# Altium schematic sheet MotorCellTwo.SchDoc: ODRIVE-FOC
size A3; DocumentNumber: SEASKY; Revision: V1.1
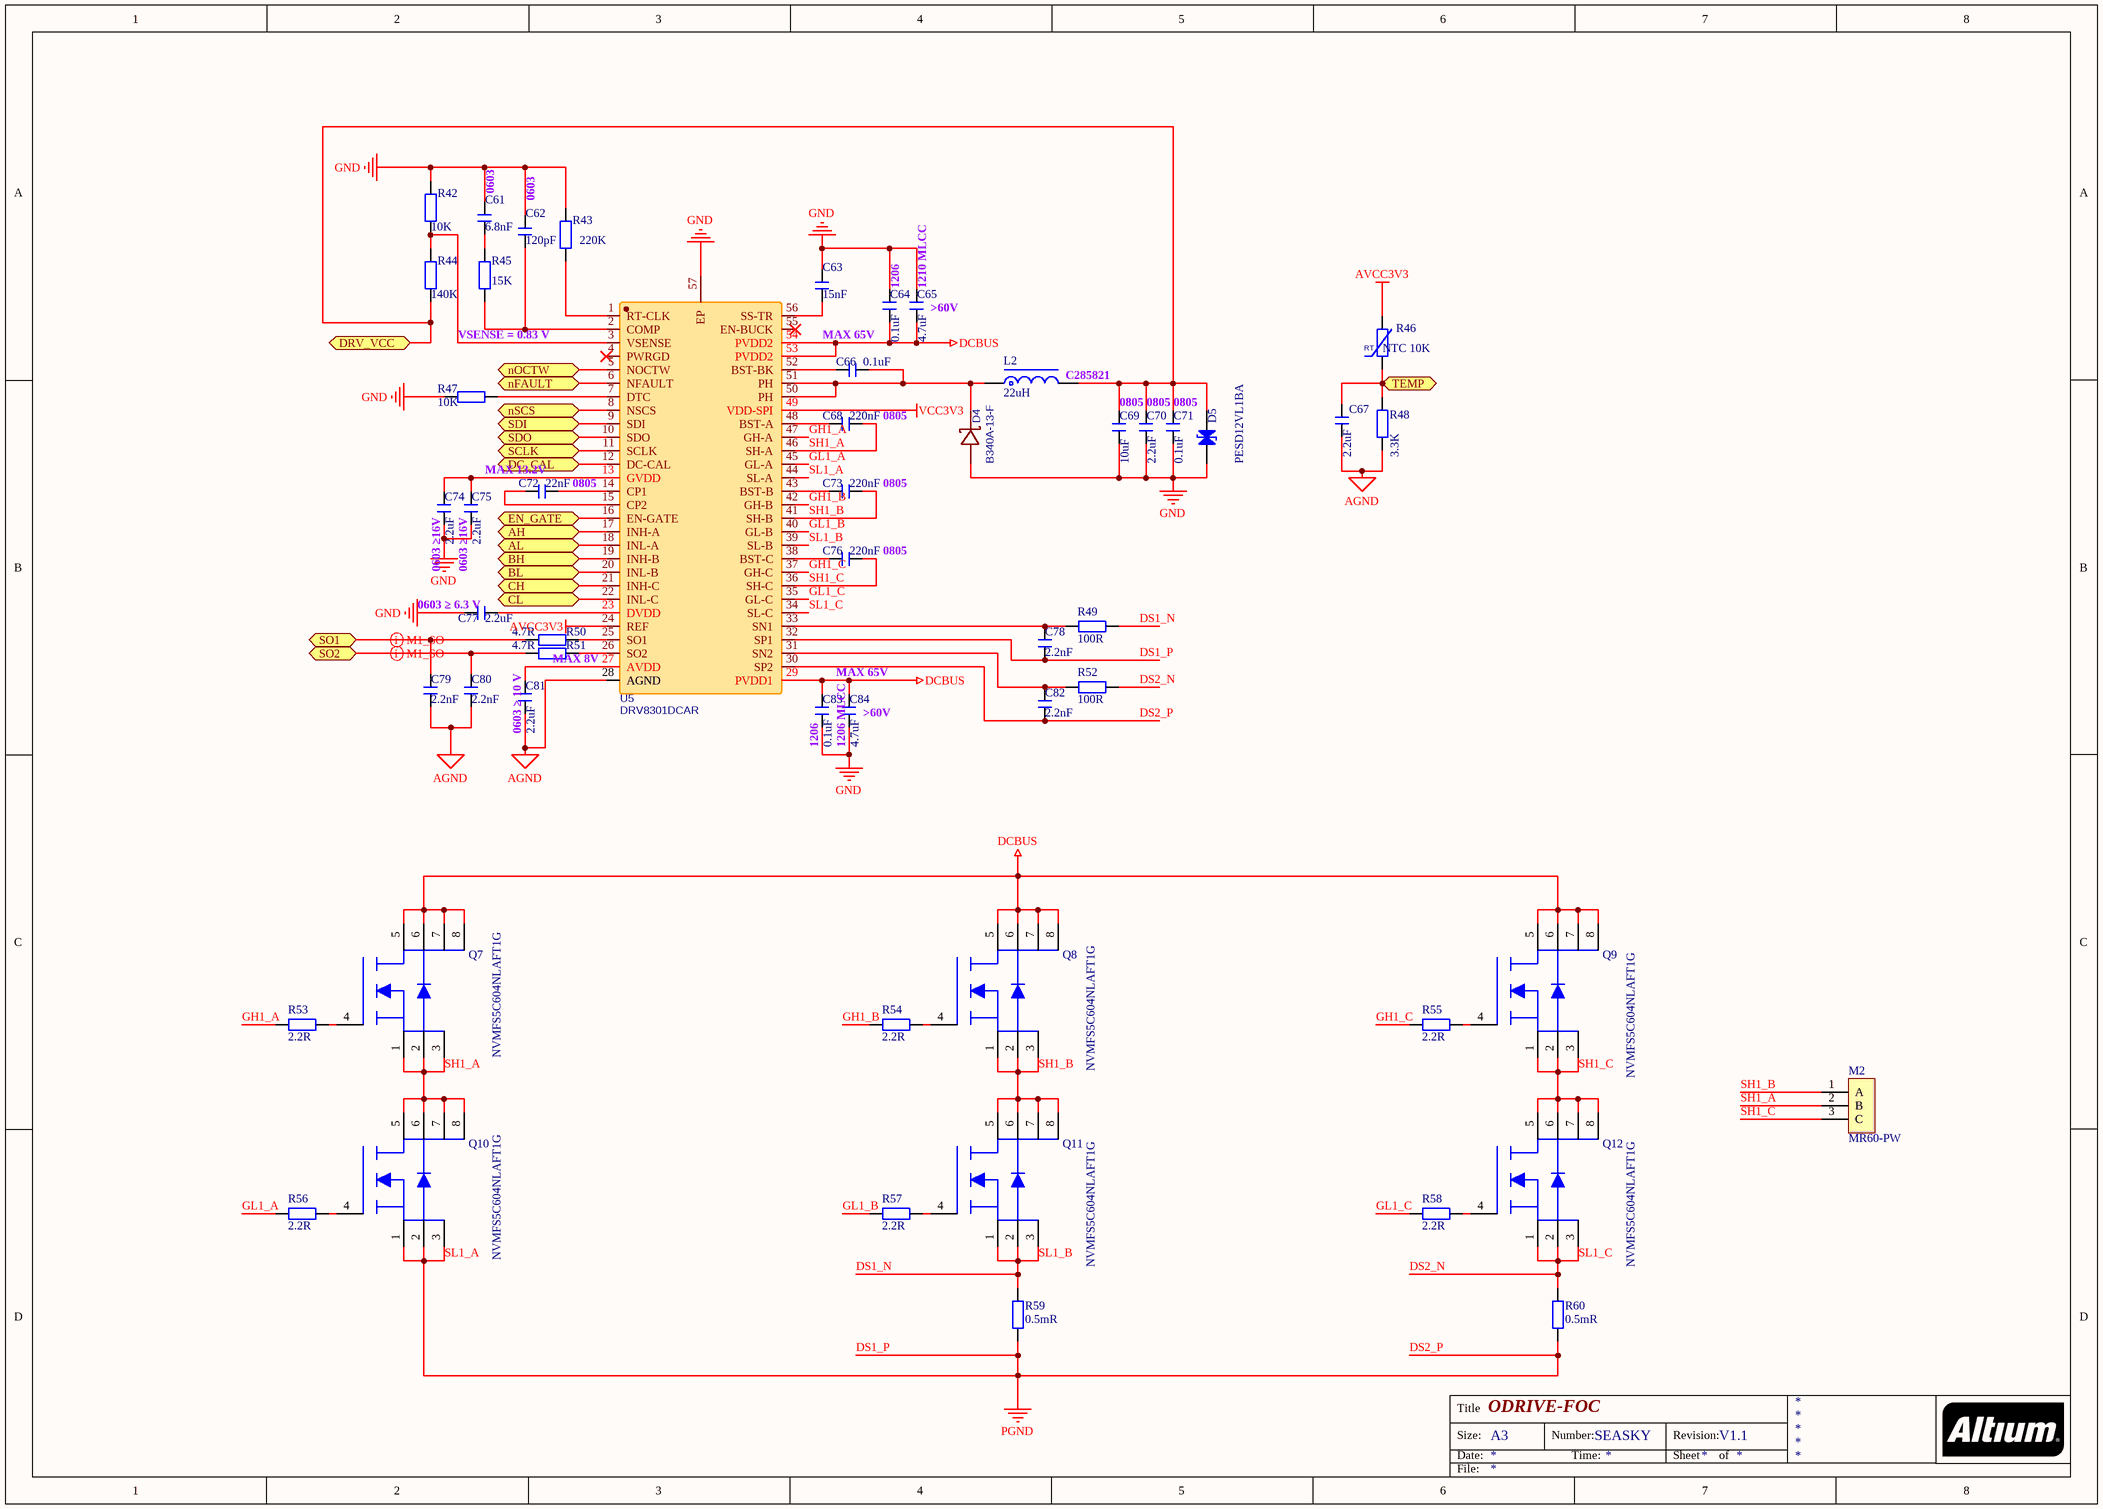
[diagram p0: MotorCellTwo.SchDoc]

## Parts
C61  6.8nF  [C 0603_L]
C62  120pF  [C 0603_L]
C63  15nF  [C 0603_L]
C64  0.1uF  [C 1206_L]
C65  4.7uF  [C 1210_L]
C66  0.1uF  [C 0603_L]
C67  2.2uF  [C 0603_L]
C68  220nF  [C 0805_L]
C69  10uF  [C 0805_L]
C70  2.2uF  [C 0805_L]
C71  0.1uF  [C 0805_L]
C72  22nF  [C 0805_L]
C73  220nF  [C 0805_L]
C74  2.2uF  [C 0603_L]
C75  2.2uF  [C 0603_L]
C76  220nF  [C 0805_L]
C77  2.2uF  [C 0603_L]
C78  2.2nF  [C 0603_L]
C79  2.2nF  [C 0603_L]
C80  2.2nF  [C 0603_L]
C81  2.2uF  [C 0603_L]
C82  2.2nF  [C 0603_L]
C83  0.1uF  [C 1206_L]
C84  4.7uF  [C 1210_L]
D4  B340A-13-F  [SMA_L4.4-W2.6-LS5.0-RD]
D5  PESD12VL1BA  [SOD-323]
L2  22uH  [CD53]
M2  MR60-PW  [MR30-PW]
Q7  NVMFS5C604NLAFT1G  [PG-TDSON-8_L5.0-W6.0-P1.27-LS6.2-BL-EP]
Q8  NVMFS5C604NLAFT1G  [PG-TDSON-8_L5.0-W6.0-P1.27-LS6.2-BL-EP]
Q9  NVMFS5C604NLAFT1G  [PG-TDSON-8_L5.0-W6.0-P1.27-LS6.2-BL-EP]
Q10  NVMFS5C604NLAFT1G  [PG-TDSON-8_L5.0-W6.0-P1.27-LS6.2-BL-EP]
Q11  NVMFS5C604NLAFT1G  [PG-TDSON-8_L5.0-W6.0-P1.27-LS6.2-BL-EP]
Q12  NVMFS5C604NLAFT1G  [PG-TDSON-8_L5.0-W6.0-P1.27-LS6.2-BL-EP]
R42  10K  [R 0603_L]
R43  220K  [R 0603_L]
R44  140K  [R 0603_L]
R45  15K  [R 0603_L]
R46  NTC 10K  [R 0805-HP_L]
R47  10K  [R 0603_L]
R48  3.3K  [R 0805_L]
R49  100R  [R 0603_L]
R50  4.7R  [R 0603_L]
R51  4.7R  [R 0603_L]
R52  100R  [R 0603_L]
R53  2.2R  [R 0603_L]
R54  2.2R  [R 0603_L]
R55  2.2R  [R 0603_L]
R56  2.2R  [R 0603_L]
R57  2.2R  [R 0603_L]
R58  2.2R  [R 0603_L]
R59  0.5mR  [R3920]
R60  0.5mR  [R3920]
U5  DRV8301DCAR  [HTSSOP-56_L14.0-W6.0-P0.50-LS8.0-BL]

## Ports
AH (bidir), AL (bidir), BH (bidir), BL (bidir), CH (bidir), CL (bidir), DC_CAL (bidir), DRV_VCC (bidir), EN_GATE (bidir), nFAULT (bidir), nOCTW (bidir), nSCS (bidir), SCLK (bidir), SDI (bidir), SDO (bidir), SO1 (bidir), SO2 (bidir), TEMP (bidir)

## Nets
AGND: C67.2 C79.1 C80.1 C81.1 R48.1 U5.28(AGND)
AVCC3V3: R46.2 U5.24(REF)
DCBUS: C64.1 C65.1 C83.2 C84.2 Q7.5 Q7.6 Q7.7 Q7.8 Q8.5 Q8.6 Q8.7 Q8.8 Q9.5 Q9.6 Q9.7 Q9.8 U5.29(PVDD1) U5.53(PVDD2) U5.54(PVDD2)
DS1_P: C78.1 C82.1 Q10.1 Q10.2 Q10.3 R59.1 R60.1 U5.30(SP2) U5.32(SP1) U5.44(SL-A)  [also labelled DS2_P, PGND, SL1_A]
GND: C61.1 C62.1 C63.1 C64.2 C65.2 C69.1 C70.1 C71.1 C74.1 C75.1 C77.1 C83.1 C84.1 D4.2(A) D5.2(K) R42.2 R43.2 R47.2 U5.57(EP)
VCC3V3: U5.49(VDD-SPI)
AH: U5.17(INH-A) ; port AH
AL: U5.18(INL-A) ; port AL
BH: U5.19(INH-B) ; port BH
BL: U5.20(INL-B) ; port BL
CH: U5.21(INH-C) ; port CH
CL: U5.22(INL-C) ; port CL
DC_CAL: U5.12(DC-CAL) ; port DC_CAL
DRV_VCC: C69.2 C70.2 C71.2 D5.1(A) L2.2 R44.1 ; port DRV_VCC
DS1_N: Q11.1 Q11.2 Q11.3 R49.2 R59.2 U5.39(SL-B)  [also labelled SL1_B]
DS2_N: Q12.1 Q12.2 Q12.3 R52.2 R60.2 U5.34(SL-C)  [also labelled SL1_C]
EN_GATE: U5.16(EN-GATE) ; port EN_GATE
GH1_A: R53.1 U5.47(GH-A)
GH1_B: R54.1 U5.42(GH-B)
GH1_C: R55.1 U5.37(GH-C)
GL1_A: R56.1 U5.45(GL-A)
GL1_B: R57.1 U5.40(GL-B)
GL1_C: R58.1 U5.35(GL-C)
nFAULT: U5.6(NFAULT) ; port nFAULT
nOCTW: U5.5(NOCTW) ; port nOCTW
nSCS: U5.8(NSCS) ; port nSCS
SCLK: U5.11(SCLK) ; port SCLK
SDI: U5.9(SDI) ; port SDI
SDO: U5.10(SDO) ; port SDO
SH1_A: C68.2 M2.2(B) Q7.1 Q7.2 Q7.3 Q10.5 Q10.6 Q10.7 Q10.8 U5.46(SH-A)
SH1_B: C73.2 M2.1(A) Q8.1 Q8.2 Q8.3 Q11.5 Q11.6 Q11.7 Q11.8 U5.41(SH-B)
SH1_C: C76.2 M2.3(C) Q9.1 Q9.2 Q9.3 Q12.5 Q12.6 Q12.7 Q12.8 U5.36(SH-C)
SO1: C79.2 R50.1 ; port SO1
SO2: C80.2 R51.1 ; port SO2
TEMP: C67.1 R46.1 R48.2 ; port TEMP
NetC61_2: C61.2 R45.2
NetC62_2: C62.2 R45.1 U5.2(COMP)
NetC63_2: C63.2 U5.56(SS-TR)
NetC66_1: C66.1 D4.1(K) L2.1 U5.50(PH) U5.51(PH)
NetC66_2: C66.2 U5.52(BST-BK)
NetC68_1: C68.1 U5.48(BST-A)
NetC72_1: C72.1 U5.14(CP1)
NetC72_2: C72.2 U5.15(CP2)
NetC73_1: C73.1 U5.43(BST-B)
NetC74_2: C74.2 C75.2 U5.13(GVDD)
NetC76_1: C76.1 U5.38(BST-C)
NetC77_2: C77.2 U5.23(DVDD)
NetC78_2: C78.2 R49.1 U5.33(SN1)
NetC81_2: C81.2 U5.27(AVDD)
NetC82_2: C82.2 R52.1 U5.31(SN2)
NetQ7_4: Q7.4 R53.2
NetQ8_4: Q8.4 R54.2
NetQ9_4: Q9.4 R55.2
NetQ10_4: Q10.4 R56.2
NetQ11_4: Q11.4 R57.2
NetQ12_4: Q12.4 R58.2
NetR42_1: R42.1 R44.2 U5.3(VSENSE)
NetR43_1: R43.1 U5.1(RT-CLK)
NetR47_1: R47.1 U5.7(DTC)
NetR50_2: R50.2 U5.25(SO1)
NetR51_2: R51.2 U5.26(SO2)

Not connected (* = marked no-connect by the designer): U5 4(PWRGD)* 55(EN-BUCK)*

## Layout directives
differential pair: SO1, SO2

## Notes on the sheet
- (near C61) 0603
- 0603
- 1206
- (near C65) >60V
- (near C65) 1210 MLCC
- VSENSE = 0.83 V
- MAX 65V
- (near L2) C285821
- 0805
- (near C72) MAX 13.2V
- (near C73) 0805
- (near C74) 0603 ≥16V
- (near C75) 0603 ≥16V
- (near C76) 0805
- (near C77) 0603 ≥ 6.3 V
- (near R51) MAX 8V
- (near C84) >60V
- (near C81) 0603 ≥ 10 V
- (near C83) 1206
- (near C84) 1206 MLCC
- Title
- Size:
- Date:
- A3
- Number:
- Time:
- Revision:
- Sheet
- of
- File:

## Library data of the parts
C61-C84 = C: 贴片电容
D4 = B340A-13-F: BOM_Manufacturer: DIODES; SMT Type: Extend; BOM_Supplier: LCSC; BOM_Manufacturer Part: B340A-13-F; BOM_Supplier Part: C85098; BOM_JLCPCB SMD: Yes; spicePre: D; spiceSymbolName: B340A-13-F
D5 = PESD5V0S1BA: PESD5V0S1BA、ESD二极管、5V
L2 = L-SMD: CD系列贴片线绕功率电感
Q7-Q12 = BSC037N08NS5ATMA1
R42-R45 R47-R58 = R: 贴片电阻
R46 = RT: 热敏电阻
R59 R60 = R-Precision: 精密贴片电阻
U5 = DRV8301DCAR: BOM_Manufacturer: Texas Instruments; Contributor: LCSC; SMT Type: Extend; BOM_Supplier: LCSC; BOM_Supplier Part: C98969; BOM_Manufacturer Part: DRV8301DCAR; BOM_JLCPCB SMD: Yes; spicePre: U; spiceSymbolName: DRV8301DCAR